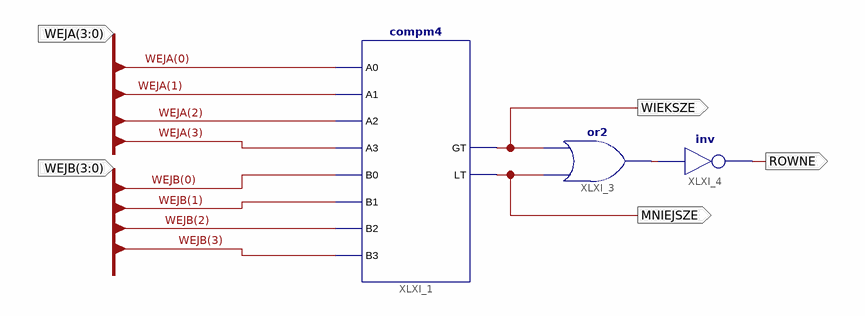
[diagram p0: schematic sheet 1]
// Xilinx ISE schematic scheme_button.sch (xc9500xl) as structural Verilog: 3 symbols, 5 ports
module scheme_button (
  input  [3:0] WEJA,
  input  [3:0] WEJB,
  output WIEKSZE,
  output MNIEJSZE,
  output ROWNE
);

  wire XLXN_1;

  compm4 XLXI_1 (
    .A0(WEJA[0]), .A1(WEJA[1]), .A2(WEJA[2]), .A3(WEJA[3]), .B0(WEJB[0]), .B1(WEJB[1]), .B2(WEJB[2]),
    .B3(WEJB[3]), .GT(WIEKSZE), .LT(MNIEJSZE));
  or XLXI_3 (XLXN_1, MNIEJSZE, WIEKSZE);
  not XLXI_4 (ROWNE, XLXN_1);
endmodule
